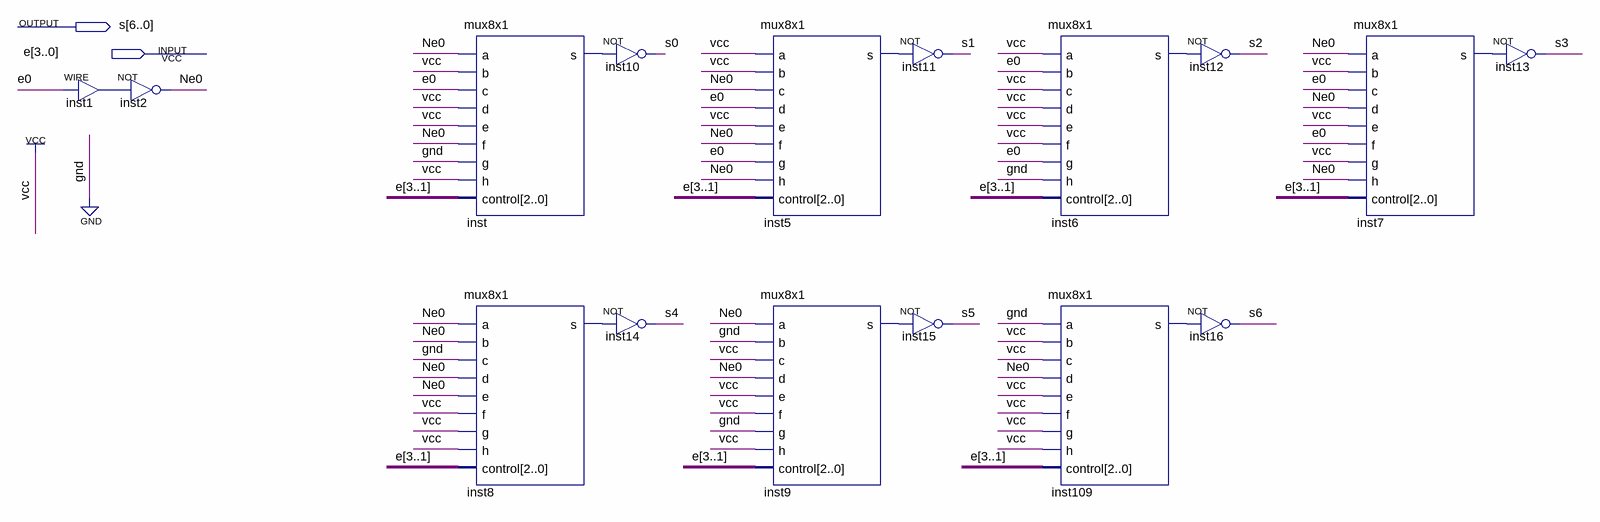
[diagram p0: schematic sheet]
// Quartus schematic Display7Seg.bdf as structural Verilog: 16 symbols, 2 pins
module Display7Seg (
  input  [3:0] e,
  output [6:0] s
);

  wire inst1_out, inst5_s, inst6_s, inst7_s, inst8_s, inst9_s, inst109_s, inst_s, Ne0;

  assign inst1_out = e[0];  // WIRE inst1
  not inst2 (Ne0, inst1_out);
  mux8x1 inst (
    .a(Ne0), .b(1'b1), .c(e[0]), .d(1'b1), .e(1'b1), .f(Ne0), .g(1'b0), .h(1'b1), .control(e[3:1]), .s(inst_s));
  mux8x1 inst8 (
    .a(Ne0), .b(Ne0), .c(1'b0), .d(Ne0), .e(Ne0), .f(1'b1), .g(1'b1), .h(1'b1), .control(e[3:1]), .s(inst8_s));
  not inst10 (s[0], inst_s);
  not inst14 (s[4], inst8_s);
  mux8x1 inst5 (
    .a(1'b1), .b(1'b1), .c(Ne0), .d(e[0]), .e(1'b1), .f(Ne0), .g(e[0]), .h(Ne0), .control(e[3:1]), .s(inst5_s));
  mux8x1 inst9 (
    .a(Ne0), .b(1'b0), .c(1'b1), .d(Ne0), .e(1'b1), .f(1'b1), .g(1'b0), .h(1'b1), .control(e[3:1]),
    .s(inst9_s));
  not inst11 (s[1], inst5_s);
  not inst15 (s[5], inst9_s);
  mux8x1 inst6 (
    .a(1'b1), .b(e[0]), .c(1'b1), .d(1'b1), .e(1'b1), .f(1'b1), .g(e[0]), .h(1'b0), .control(e[3:1]),
    .s(inst6_s));
  mux8x1 inst109 (
    .a(1'b0), .b(1'b1), .c(1'b1), .d(Ne0), .e(1'b1), .f(1'b1), .g(1'b1), .h(1'b1), .control(e[3:1]),
    .s(inst109_s));
  not inst12 (s[2], inst6_s);
  not inst16 (s[6], inst109_s);
  mux8x1 inst7 (
    .a(Ne0), .b(1'b1), .c(e[0]), .d(Ne0), .e(1'b1), .f(e[0]), .g(1'b1), .h(Ne0), .control(e[3:1]), .s(inst7_s));
  not inst13 (s[3], inst7_s);
endmodule
